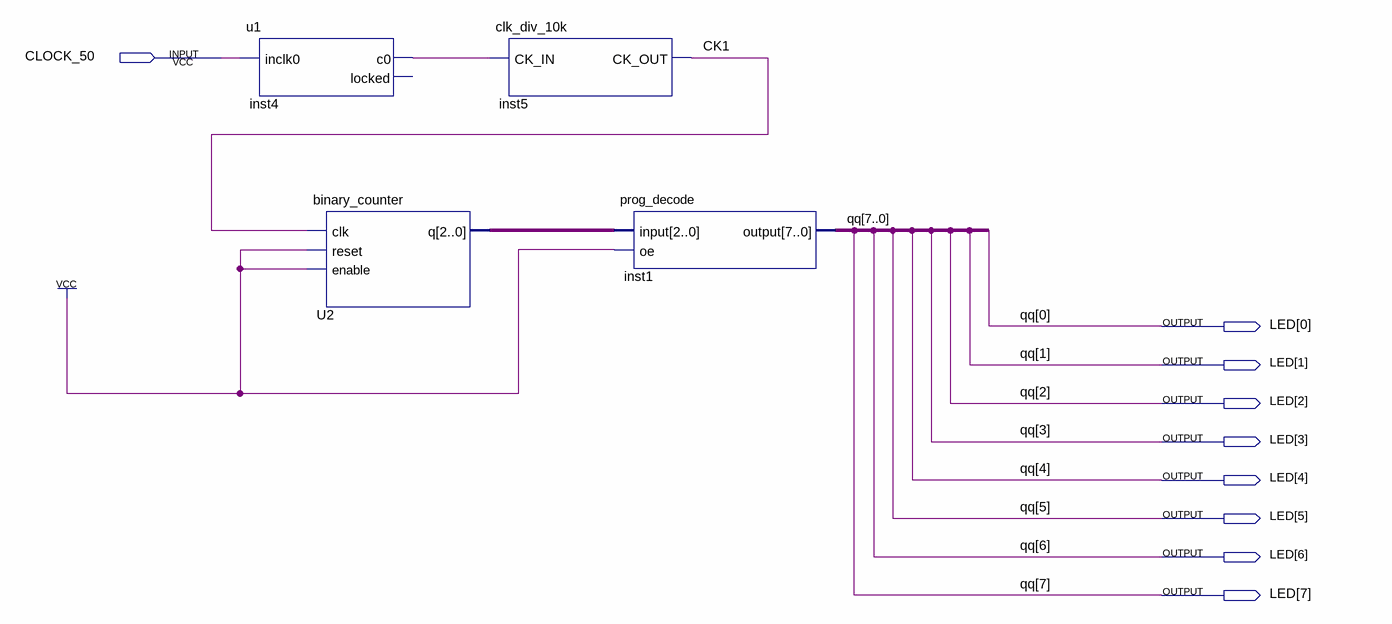
[diagram p0: schematic sheet]
// Quartus schematic top_level.bdf as structural Verilog: 4 symbols, 9 pins
module top_level (
  input  CLOCK_50,
  output [7:0] LED
);

  wire CK1, inst4_c0;
  wire [2:0] U2_q;

  u1 inst4 (.inclk0(CLOCK_50), .c0(inst4_c0));  // open: locked
  binary_counter U2 (.clk(CK1), .reset(1'b1), .enable(1'b1), .q(U2_q));
  clk_div_10k inst5 (.CK_IN(inst4_c0), .CK_OUT(CK1));
  prog_decode inst1 (.\input (U2_q), .oe(1'b1), .\output (LED));

  // Other names for the same wires on the sheet: qq[7:0] = LED
endmodule
